# Altium schematic sheet input.SCHDOC: 8+2 Acquisition Board
size B; Engineer: Eric Jonas (jonas@mwl.mit.edu); Organization: PILM, MIT; Address1: 46-5227; Address2: 43 Vassar St.; Address3: Cambridge, MA 02139; Address4: Australia 2086
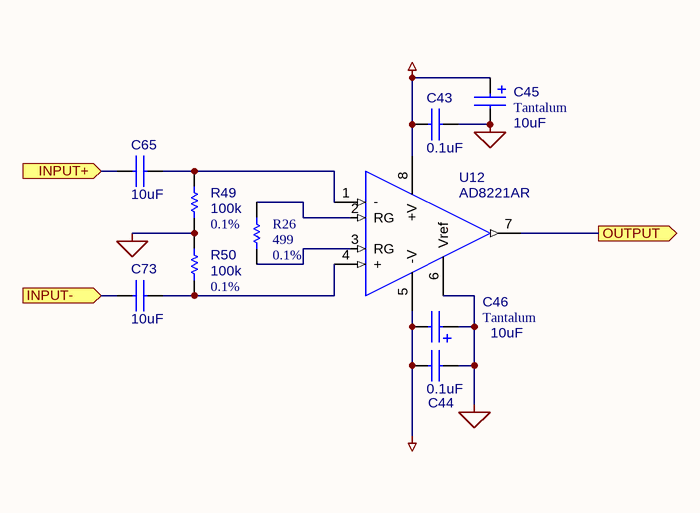
[diagram p0: input.SCHDOC]

## Parts
C43  value 0.1uF  [0603]  (hidden comment: CAPACITOR)
C44  value 0.1uF  [0603]  (hidden comment: CAPACITOR)
C45  value 10uF  [3216]  (hidden comment: Tantalum)
C46  value 10uF  [3216]  (hidden comment: Tantalum)
C65  value 10uF  [0805]  (hidden comment: CAPACITOR)
C73  value 10uF  [0805]  (hidden comment: CAPACITOR)
R26  value 499  Tolerance: 0.1%  [0603]
R49  value 100k  Tolerance: 0.1%  [0603]
R50  value 100k  Tolerance: 0.1%  [0603]
U12  AD8221AR  [SO-G8]

## Ports
INPUT+ (in), INPUT- (in), OUTPUT (out)

## Nets
AGND: C43.2 C44.2 C45.2 C46.1 R49.2 R50.1 U12.6(Vref)
AVDD: C43.1 C45.1 U12.8(+V)
AVSS: C44.1 C46.2 U12.5(-V)
INPUT+: C65.1 ; port INPUT+
INPUT-: C73.1 ; port INPUT-
OUTPUT: U12.7(Vout) ; port OUTPUT
NetC65_2: C65.2 R49.1 U12.1(-)
NetC73_2: C73.2 R50.2 U12.4(+)
NetR26_1: R26.1 U12.2(RG)
NetR26_2: R26.2 U12.3(RG)

## Notes on the sheet
- Title:
- Engineer:
- Date:
- Revision:
- Sheet
- of
- File:

## Library data of the parts
C43 C44 C65 C73 = CAPACITOR: Standard Capacitor
C45 C46 = POLCAP: Standard Capacitor; Type: Tantalum
R26 R49 R50 = RESISTOR: Standard Passive Resistor
U12 = AD8221: AD8221 Precision Instrumentation Amplifier; Vendor: Analog Devices; Part: AD8221AR